# EAGLE design feather (EAGLE 9.5.2)
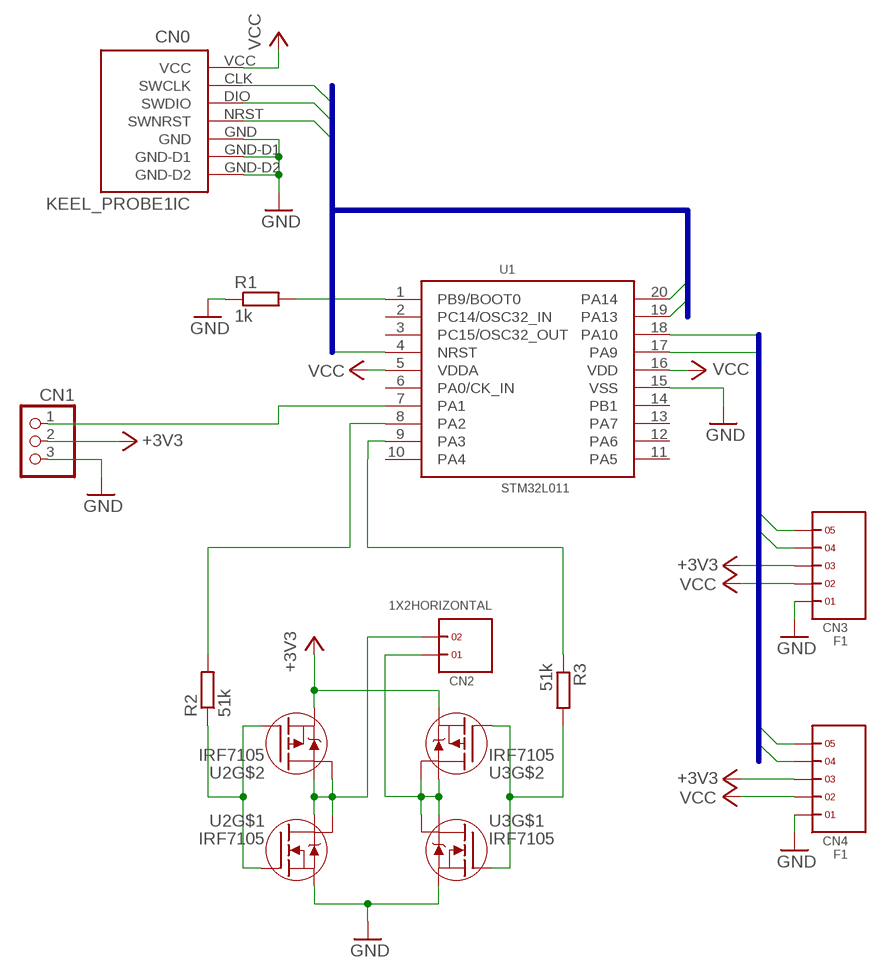
[diagram p0: schematic, sheet 1]

## Parts
CN0  KEEL_PROBE1IC  [KEEL_PROBE-IC1]
CN1  PINHD-1X3/90  [1X03/90]
CN2  1X2HORIZONTAL  [1X2H]
CN3  F1  1X5HORIZONTAL  [1X5H]
CN4  F1  1X5HORIZONTAL  [1X5H]
R1  1k  R-EU_R0805  [R0805]
R2  51k  R-EU_R0805  [R0805]
R3  51k  R-EU_R0805  [R0805]
U1  STM32L011  [SSOP20]
U2  IRF7105  [SO8-2]
U3  IRF7105  [SO8-2]

## Nets
+3V3: CN1.2 CN3.3 CN4.3 U2.3(S) U3.3(S)
GND: CN0.GND CN0.GND-D1 CN0.GND-D2 CN1.3 CN3.1 CN4.1 R1.1 U1.15(VSS) U2.1(S) U3.1(S)
I2C_SCL: CN3.4 CN4.4 U1.17(PA9)
I2C_SDA: CN3.5 CN4.5 U1.18(PA10)
N$1: CN2.2 U2.5(D) U2.6(D) U2.7(D) U2.8(D)
N$2: R3.1 U1.9(PA3)
N$3: R3.2 U3.2(G) U3.4(G)
N$4: CN2.1 U3.5(D) U3.6(D) U3.7(D) U3.8(D)
N$5: R2.2 U1.8(PA2)
N$6: R2.1 U2.2(G) U2.4(G)
N$7: R1.2 U1.1(PB9/BOOT0)
N$8: CN1.1 U1.7(PA1)
NRST: CN0.NRST(SWNRST) U1.4(NRST)
SWCLK: CN0.CLK(SWCLK) U1.20(PA14)
SWDIO: CN0.DIO(SWDIO) U1.19(PA13)
VCC: CN0.VCC CN3.2 CN4.2 U1.5(VDDA) U1.16(VDD)
Unconnected: U1.2(PC14/OSC32_IN) U1.3(PC15/OSC32_OUT) U1.6(PA0/CK_IN) U1.10(PA4) U1.11(PA5) U1.12(PA6) U1.13(PA7) U1.14(PB1)

## Buses
I2C:I2C_SCL,I2C_SDA
PROBE:NRST,SWCLK,SWDIO,VCC

## Library data of the parts
CN0 = probe:KEEL_PROBE1: In-circuit probe for the Keel module
CN1 = con-pinhead:PINHD-1X3: PIN HEADER
CN2 = con-pinhead-2mm:1X2
CN3 CN4 = con-pinhead-2mm:1X5: 2.0mm HDR 5pos HPI
R1-R3 = rcl:R-EU_: RESISTOR, European symbol; SPICEPREFIX: R
U1 = st:STM32L011
U2 U3 = irf-2:IRF7105: HEXFET® Power MOSFET Adavanced Process Technology Ultra Low On-Resistance Dual N and P Channel MOSFET Surface Mount Available in Tape & Reel Dynamic dv/dt Rating Fast Switching Please connect both Drain-Pins of each FET for thermal Reasons! (Pin 5 with Pin 6, 7 with 8)

## Board
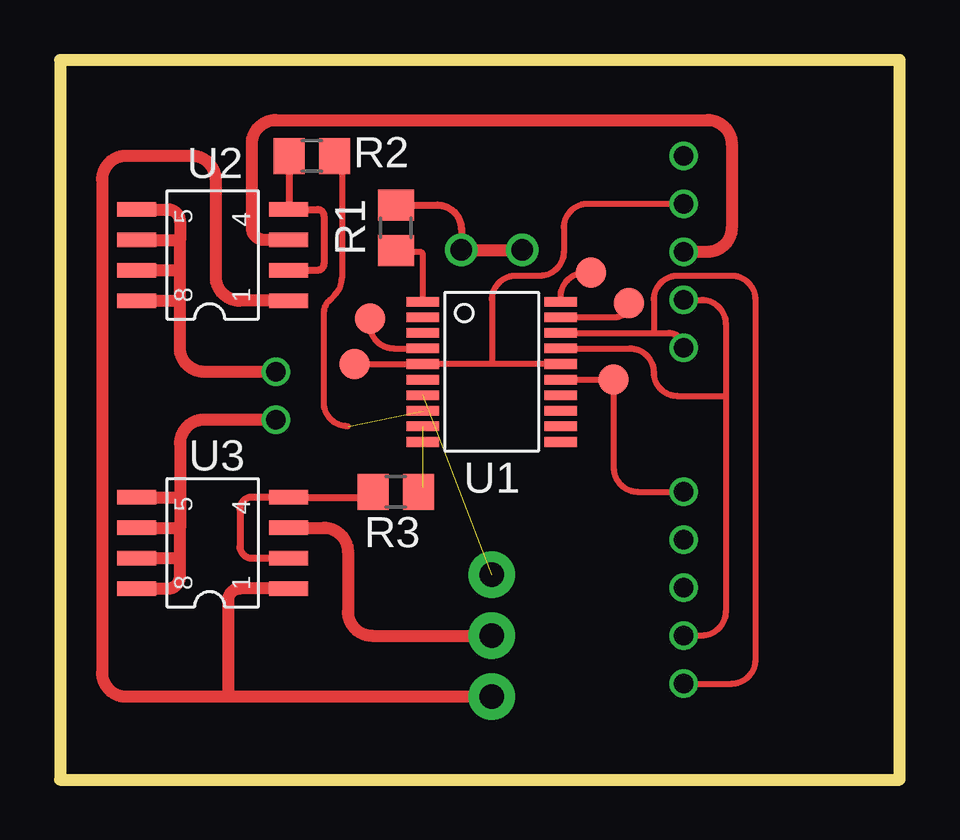
[diagram p1: board, top side]
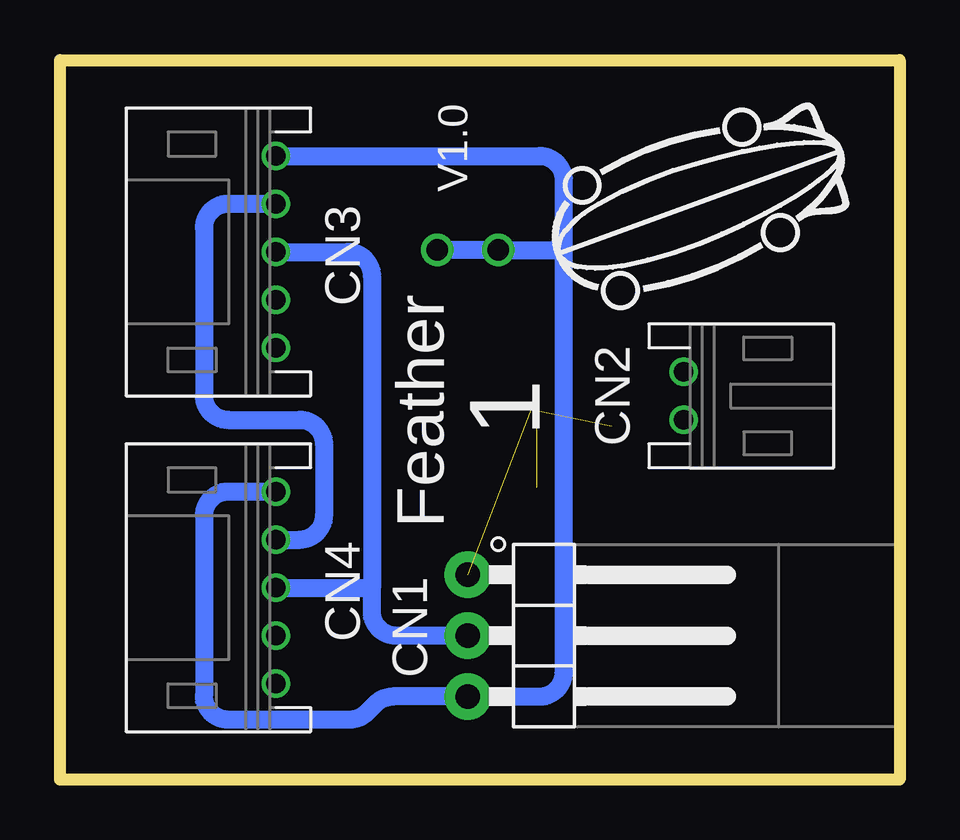
[diagram p2: board, bottom side, seen from below]

Size 35 x 30 mm. Coordinates in mm from the lower left corner, seen from the top.
Outline: 0,0 35,0 35,30 0,30 0,0
Copper layers (1*16): Top 0.035mm / dielectric 1.55mm / Bottom 0.035mm
Design rules "wedirekt": minimum track width 0.15mm, minimum drill 0.25mm, track to track 0.15mm, track to pad 0.15mm, pad to pad 0.15mm, via to via 0.15mm, smd to smd 0.15mm, copper to edge 40mil, drill to drill 40mil, minimum pad ring 0.125mm, minimum via ring 0.125mm, stop-mask expansion 0.03mm, vias tented up to drill 0.25mm, thermal gap 10mil

### Footprints (pad centres in the part's own frame; a part is rotated, then mirrored left to right if it is on the bottom)
KEEL_PROBE-IC1 = smd 1.27 x 1.27: CLK 4.128,4.128; DIO 5.715,2.857; GND 5.08,-0.318; NRST -5.08,2.223; VCC -5.715,0.318 | drill 0.9: GND-D1 -1.27,5.08; GND-D2 1.27,5.08
1X03/90 = drill 1.016 pad 1.93: 1 -2.54,0; 2 0,0; 3 2.54,0
1X2H = drill 0.8: 1 1,0; 2 -1,0
1X5H = drill 0.8: 1 4,0; 2 2,0; 3 0,0; 4 -2,0; 5 -4,0
R0805 = smd 1.3 x 1.5: 1 -0.95,0; 2 0.95,0
SSOP20 = smd 0.4 x 1.35: 1 -2.925,-2.875; 2 -2.275,-2.875; 3 -1.625,-2.875; 4 -0.975,-2.875; 5 -0.325,-2.875; 6 0.325,-2.875; 7 0.975,-2.875; 8 1.625,-2.875; 9 2.275,-2.875; 10 2.925,-2.875; 11 2.925,2.875; 12 2.275,2.875; 13 1.625,2.875; 14 0.975,2.875; 15 0.325,2.875; 16 -0.325,2.875; 17 -0.975,2.875; 18 -1.625,2.875; 19 -2.275,2.875; 20 -2.925,2.875
SO8-2 = smd 0.61 x 1.626: 1 -2.54,-2.54; 2 -1.27,-2.54; 3 0,-2.54; 4 1.27,-2.54; 5 1.27,3.81; 6 0,3.81; 7 -1.27,3.81; 8 -2.54,3.81

### Placement (x,y rotation side)
CN0  18,17 0 top
CN1  18,6 270 bottom
CN2  9,16 270 bottom
CN3  26,22 90 bottom
CN4  26,8 90 bottom
E$5  [ZEPPELIN]  8.5,24 110 bottom
R1  14,23 270 top
R2  10.5,26 0 top
R3  14,12 180 top
U1  18,17 270 top
U2  7,22.5 90 top
U3  7,10.5 90 top

### Tracks (layer width: path | path; a pad name or v marks a point on that pad's centre or on a via)
+3V3
  Top 0.5: U2.3 8.5,22.5 arc-90 8,23 8,26.5 arc-90 9,27.5 27,27.5 arc-90 28,26.5 28,23 arc-90 27,22 CN3.3 | U3.3 11,10.5 arc-90 12,9.5 12,7 arc90 13,6 CN1.2
  Bottom 0.75: 22,8 22,7 arc-90 21,6 CN1.2 | CN4.3 22,8 | CN3.3 23,22 arc90 22,21 22,8
GND
  Top 0.25: U1.15 CN0.GND arc90 CN0.GND 23.08,13 arc90 24.08,12 CN4.1
  Top 0.3: R1.1 15.73,23.95 arc-90 16.73,22.95 CN0.GND-D1
  Top 0.5: U2.1 7.5,19.96 arc-90 6.5,20.96 6.5,25 arc90 5.5,26 2.75,26 arc90 1.75,25 1.75,4.46 arc90 2.75,3.46 7,3.46 | CN0.GND-D1 CN0.GND-D2 | 7,3.46 CN1.3 | U3.1 7.5,7.96 arc90 7,7.46 7,3.46
  Bottom 0.75: CN4.1 28,12 arc-90 29,11 29,3.5 arc-90 28,2.5 22.91,2.5 arc-45 22.21,2.79 21.83,3.17 arc45 21.13,3.46 CN1.3 15,3.46 arc-90 14,4.46 14,22 | 14,22 14,25 arc-90 15,26 CN3.1 | CN0.GND-D2 CN0.GND-D1 14.08,22.08 arc90 14,22
I2C_SCL
  Top 0.25: U1.17 23.75,17.98 arc-90 24.75,16.98 arc90 25.73,16 27.75,16 | CN3.4 26.75,20 arc-90 27.75,19 27.75,16 | CN4.4 26.75,6 arc90 27.75,7 27.75,16
I2C_SDA
  Top 0.25: U1.18 24.75,18.62 | 24.75,18.62 25.38,18.62 arc-90 CN3.5 | CN4.5 28,4 arc90 29,5 29,20 arc90 28,21 25.75,21 arc90 24.75,20 24.75,18.62
N$1
  Top 0.5: CN2.2 6,17 arc-90 5,18 5,19.96 | 5,19.96 5,21.23 | 5,21.23 5,22.5 | U2.8 5,19.96 | U2.7 5,21.23 | U2.6 5,22.5 | U2.5 4.5,23.77 arc-90 5,23.27 5,22.5
N$2  (1 unrouted)
  Top 0.3: 15.12,12.18 arc-90 R3.1
N$3
  Top 0.3: R3.2 arc-90 12.82,11.77 U3.4 8,11.77 arc90 7.5,11.27 7.5,9.73 arc90 8,9.23 U3.2
N$4
  Top 0.5: CN2.1 6,15 arc90 5,14 5,11.77 | 5,11.77 5,10.5 | U3.7 5,9.23 | 5,9.23 5,10.5 | U3.6 5,10.5 | U3.5 5,11.77 | U3.8 4.5,7.96 arc90 5,8.46 5,9.23
N$5  (1 unrouted)
  Top 0.25: 11.75,25.7 arc90 R2.2 arc-90 11.75,25.7 | 12,14.72 arc-90 11,15.72 11,19.4 arc-45 11.25,20 11.46,20.21 arc45 11.75,20.91 11.75,25.7
N$6
  Top 0.3: U2.2 10.73,21.23 arc90 11,21.5 11,23.5 arc90 10.73,23.77 U2.4 arc90 U2.4 R2.1
N$7
  Top 0.152: 14.02,22.03 R1.2
  Top 0.25: U1.1 15.12,21.88 arc90 15,22 14.05,22 arc-90 14.02,22.03
N$8  (1 unrouted)
NRST
  Top 0.25: CN0.NRST 12.92,18.98 arc90 13.92,17.98 U1.4
SWCLK
  Top 0.25: U1.20 20.88,20.13 arc-90 21.88,21.13 CN0.CLK
SWDIO
  Top 0.25: U1.19 23.13,19.27 arc90 CN0.DIO
VCC
  Top 0.25: CN0.VCC U1.5 arc90 U1.5 18,17.32 | U1.16 18,17.32 | CN3.2 22,24 arc90 21,23 21,22 arc-90 20,21 19,21 arc90 18,20 18,17.32
  Bottom 0.75: CN4.2 25,10 arc-90 24,11 24,14 arc-90 25,15 28,15 arc90 29,16 29,23 arc90 28,24 CN3.2

### Text on the board
bNames: V1.0 | 1 | Feather